# Altium project SPEC_A7.PrjPcb (part 7 of 7)

## Sheet TOD.SchDoc: SPEC-A7
size 420 x 297 mm; Author: G.Kasprowicz; CompanyName: WUT ISE; DrawnBy: G.Kasprowicz; Organization: WUT ISE; Address1: PW ISE; Address2: Nowowiejska 15/19 00-665 Warsaw; Address3: gkasprow@gmail.com; Revision: 2; SheetNumber: 17; SheetTotal: 18; ModifiedBy: -; CheckedDate: -; Title2: TOD IN & OUT; DivGrp: WUT ISE; Designer: G.Kasprowicz; ModifiedDate: -; ProjectName: Sensor Box
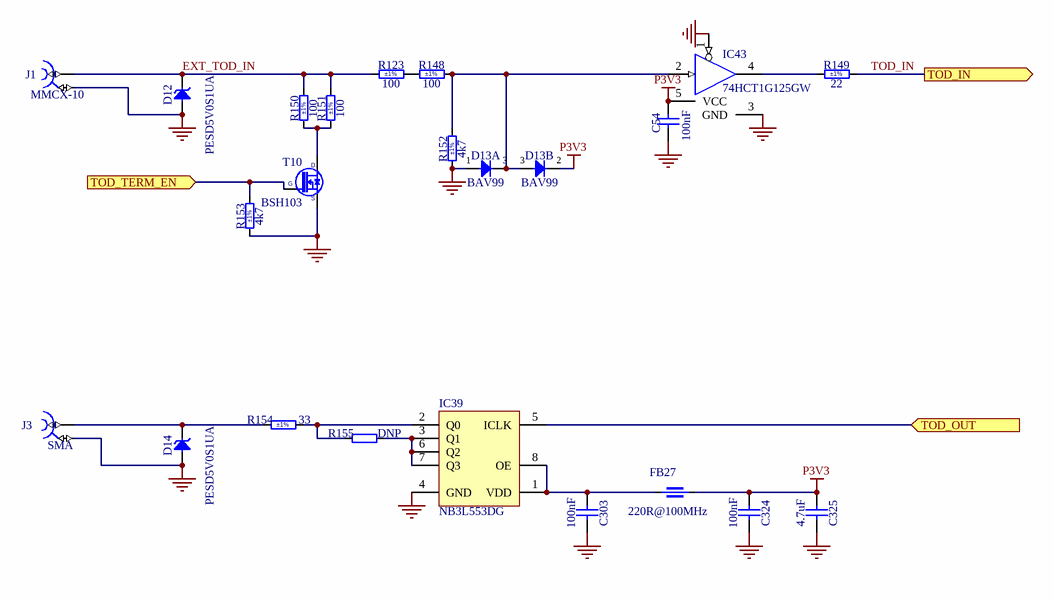
[diagram p16: TOD.SchDoc]

### Parts
C54  100nF  [CAPC0603X33N]
C303  100nF  [CAPC0603X33N]
C324  100nF  [CAPC0603X33N]
C325  4.7uF  [CAPC1005X55N]
D12  PESD5V0S1UA  [SOD2512X110N]
D13  BAV99  [SOT95P240X110-3N]  (parts A,B of 2)
D14  PESD5V0S1UA  [SOD2512X110N]
FB27  220R@100MHz  [INDC1608X95N]
IC39  NB3L553DG  [SOIC127P600X175-8N]
IC43  74HCT1G125GW  [SOT65P210X110-5N]
J1  MMCX-10  [SAMTEC_MMCX-J-P-H-ST-TH1]
J3  SMA  [DELOCK_65848]
R123  100  Tolerance: ±1%  [RESC1005X40N]
R148  100  Tolerance: ±1%  [RESC1005X40N]
R149  22  Tolerance: ±1%  [RESC1005X40N]
R150  100  Tolerance: ±1%  [RESC1005X40N]
R151  100  Tolerance: ±1%  [RESC1005X40N]
R152  4k7  Tolerance: ±1%  [RESC1005X40N]
R153  4k7  Tolerance: ±1%  [RESC1005X40N]
R154  33  Tolerance: ±1%  [RESC2012X60N]
R155  DNP  [RESC1005X40N]  (no BOM)
T10  BSH103  [SOT95P230X110-3N]

### Ports
TOD_IN (out, see SPEC-A7-TOP[3B], FPGA_34[2C]), TOD_OUT (in, see SPEC-A7-TOP[3B], FPGA_34[2D]), TOD_TERM_EN (in, see SPEC-A7-TOP[3B], FPGA_34[2C])

### Nets
GND: C54.1 C303.1 C324.1 C325.1 D12.2(A) D13.1(A) D14.2(A) IC39.4(GND) IC43.1(~{G}) IC43.3(GND) J1.2 J3.2 R152.1 R153.1 T10.2(S)
P3V3: C54.2 C324.2 C325.2 D13.2(C) FB27.1 IC43.5(VCC)
EXT_TOD_IN: D12.1(C) J1.1 R123.1 R150.2 R151.2
TOD_IN: R149.2 ; port TOD_IN
TOD_OUT: IC39.5(ICLK) ; port TOD_OUT
NetC303_2: C303.2 FB27.2 IC39.1(VDD) IC39.8(OE)
NetD13_3: D13.3(COMAC) IC43.2(IN) R148.2 R152.2
NetD14_1: D14.1(C) J3.1 R154.1
NetIC4_T3: R153.2 T10.1(G) ; port TOD_TERM_EN
NetIC39_2: IC39.2(Q0) R154.2 R155.1
NetIC39_3: IC39.3(Q1) IC39.6(Q2) IC39.7(Q3) R155.2
NetIC43_4: IC43.4(OUT) R149.1
NetR123_2: R123.2 R148.1
NetR150_1: R150.1 R151.1 T10.3(D)

### Notes on the sheet
- Project/Equipment
- Document
- Designer
- Drawn by
- Check.by
- Copyright WUT ISE 2024.
  This documentation describes Open Hardware and is licensed under the CERN OHL v.2. You may redistribute and modify this documentation under the terms of the CERN OHL v.2. (http://ohwr.org/CERNOHL). This documentation is distributed WITHOUT ANY EXPRESS OR IMPLIED WARRANTY, INCLUDING OF MERCHANTABILITY, SATISFACTORY QUALITY AND FITNESS FOR A PARTICULAR PURPOSE. Please see the CERN OHL v.2 for applicable conditions.
- Contact
- File
- Last Mod.
- Print Date
- Sheet
- Size
- A3
- of
- Rev

### Library data of the parts
C54 C303 C324 = CC0201_100NF_6.3V_10%_X5R: Non-polarised capacitor; Part Description: SMD Multilayer Chip Ceramic Capacitor; Manufacturer: GENERIC; Manufacturer1 Part Number: 02016D104KAT2A; Voltage: 6.3V; TC: X5R; Tolerance: ±10%; Part Number: CC0201_100NF_6.3V_10%_X5R; Component Kind: Standard; Component Type: Standard; Pin Count: 2; Value: 100nF; Status: Not Recommended; Manufacturer Part Number: CC0201_100NF_6.3V_10%_X5R; Case: 0201; Mounted: Yes; Socket: No; SMD: Yes; Sense: No; Manufacturer1 Example: AVX; Manufacturer1 ComponentHeight: 0.33mm; HelpURL: \\cern.ch\dfs\Applications\Altium\Datasheets\CC0201_X5R_AVX.pdf; Author: CERN DEM JLC; CreateDate: 03.12.2007; LatestRevisionDate: 03.12.2007
C325 = CC0402_4.7UF_6.3V_20%_X5R: Non-polarised capacitor; Part Description: SMD Multilayer Chip Ceramic Capacitor; Manufacturer: GENERIC; Manufacturer1 Part Number: C1005X5R0J475M050BC; Voltage: 6.3V; TC: X5R; Tolerance: ±20%; Part Number: CC0402_4.7UF_6.3V_20%_X5R; Component Kind: Standard; Component Type: Standard; Pin Count: 2; Value: 4.7uF; Status: Preferred; Manufacturer Part Number: CC0402_4.7UF_6.3V_20%_X5R; Case: 0402; Mounted: Yes; Socket: No; SMD: Yes; Sense: No; Manufacturer1 Example: TDK; Manufacturer1 ComponentHeight: 0.65mm; HelpURL: \\cern.ch\dfs\Applications\Altium\Datasheets\CC0402_X5R_TDK_C.pdf; Author: CERN DEM JLC; CreateDate: 03.03.2015; LatestRevisionDate: 03.03.2015
D12 D14 = PESD5V0S1UA: Transient Voltage Suppressor Diode (Uni-Directional); Part Description: Unidirectional ESD Protection for Transient Voltage Suppression; Manufacturer: NXP SEMICONDUCTORS; Voltage: 5V; Power: 890W; PressFit: No; Bonding: No; Part Number: PESD5V0S1UA; Component Kind: Standard; Component Type: Standard; Device: PESD5V0S1UA; PackageDescription: Small Outline Diode (SOD-323), 1.70mm W X 1.25mm L X 1.10mm H body,  IPC Medium Density; Manufacturer Part Number: PESD5V0S1UA; Pin Count: 2; Case: SOD-323; Mounted: Yes; Socket: No; SMD: Yes; Sense: No; ComponentHeight: 1.1mm; HelpURL: \\cern.ch\dfs\Applications\Altium\Datasheets\PESD5V0S1UA.pdf; Author: CERN DEM JLC; CreateDate: 28.08.2012; LatestRevisionDate: 18.09.2013
D13 = BAV99: Serial Diode; Part Description: Dual Series Signal Diode; Manufacturer: FAIRCHILD SEMICONDUCTOR; Voltage: 70V; Power: 350mW; PressFit: No; Bonding: No; Part Number: BAV99; Component Kind: Standard; Component Type: Standard; Device: BAV99; PackageDescription: SOT, 0.95mm Pitch; 3 Pin, 1.40mm W X 3.00mm L X 1.10mm H body, IPC Medium Density; Manufacturer Part Number: BAV99; Pin Count: 3; Case: SOT23-3; Mounted: Yes; Socket: No; SMD: Yes; Sense: No; ComponentHeight: 1.1mm; HelpURL: \\cern.ch\dfs\Applications\Altium\Datasheets\BAV99.pdf; Author: CERN DEM JLC; CreateDate: 06.05.2008; LatestRevisionDate: 27.09.2012
FB27 = IND0603_MURATA_BLM18SG221TN1: Part Description: SMD EMIFIL Suppression Chip Ferrite Bead; Manufacturer: MURATA; Tolerance: ±25%; Power: 2.5A; Resistance: 0.04R; Part Number: IND0603_MURATA_BLM18SG221TN1; Component Kind: Standard; Component Type: Standard; Pin Count: 2; Value: 220R@100MHz; Manufacturer Part Number: BLM18SG221TN1; Case: 0603; Mounted: Yes; Socket: No; SMD: Yes; Sense: No; ComponentHeight: 0.95mm; HelpURL: \\cern.ch\dfs\Applications\Altium\Datasheets\IND0603_MURATA_BLM18S.pdf; Author: CERN DEM MR; CreateDate: 08.01.2016; LatestRevisionDate: 25.10.2018
IC43 = 74HCT1G125GW: Single Bus Buffer Gate With 3-State Output; Part Description: Bus Buffer/Line Driver 3-State; Manufacturer: NEXPERIA; PressFit: No; Bonding: No; Part Number: 74HCT1G125GW; Component Kind: Standard; Component Type: Standard; Device: 74HCT1G125GW; PackageDescription: SOT353, SC70-5, 0.65mm Pitch; 5 Pin, 1.25mm W X 2.00mm L X 1.10mm H body, IPC Medium Density; Manufacturer Part Number: 74HCT1G125GW; Pin Count: 5; Case: SOT353; Mounted: Yes; Socket: No; SMD: Yes; Sense: No; ComponentHeight: 1.1mm; Author: CERN DEM JMW; HelpURL: \\cern.ch\dfs\Applications\Altium\Datasheets\74HCT1G125GW.pdf; CreateDate: 06.08.2020; LatestRevisionDate: 06.08.2020
J1 = SAMTEC_MMCX-J-P-H-ST-TH1: Part Description: Straight Through-hole 50 Ohms Micro Mini RF Jack, MMCX Series; PressFit: No; Part Number: MMCX-10; Component Kind: Standard; Component Type: Standard; Pin Count: 2; Mounted: Yes; Socket: No; SMD: No; Sense: No; Status: None; Manufacturer Part Number: MMCX-10; ComponentHeight: 4.35mm; Author: CERN DEM JLC; CreateDate: 05.12.2012; LatestRevisionDate: 05.12.2012
J3 = DELOCK_65848: 50 Ohm Through Hole SMA Right Angle PCB Jack; Manufacturer: DELOCK; Manufacturer Part Number: 5848 (4043619658480); PressFit: No; Part Number: DELOCK_65848; Component Kind: Standard; Component Type: Standard; Pin Count: 5; Family: SMA; Mounted: Yes; Socket: No; SMD: No; Sense: No; Status: None; Part Description: 50 Ohm Through Hole SMA Right Angle PCB Jack; ComponentHeight: 12.5; HelpURL: \\cern.ch\dfs\Applications\Altium\Datasheets\AMPHENOL_132203-16.pdf; Author: GK; CreateDate: 13.05.2019; LatestRevisionDate: 13.05.2019
R123 R148 R150 R151 = R0402_100R_1%_0.0625W_100PPM: Resistor - 1%; Part Description: General Purpose Thick Film Chip Resistor; Manufacturer: GENERIC; Manufacturer1 Part Number: 232270671001L; TC: ±100ppm/°C; PressFit: No; Part Number: R0402_100R_1%_0.0625W_100PPM; Component Kind: Standard; Component Type: Standard; Pin Count: 2; Value: 100; Status: Not Recommended; Power: 0.0625W; Manufacturer Part Number: R0402_100R_1%_0.0625W_100PPM; Case: 0402; Mounted: Yes; Sense: No; Socket: No; SMD: Yes; Manufacturer1 Example: YAGEO PHYCOMP; Manufacturer1 ComponentHeight: 0.4mm; HelpURL: \\cern.ch\dfs\Applications\Altium\Datasheets\R0402_Phycomp_RC0402.pdf; Author: CERN DEM JLC; CreateDate: 03.12.2007; LatestRevisionDate: 17.10.2012
R149 = R0402_22R_1%_0.0625W_100PPM: Resistor - 1%; Part Description: General Purpose Thick Film Chip Resistor; Manufacturer: GENERIC; Manufacturer1 Part Number: 232270672209L; TC: ±100ppm/°C; PressFit: No; Part Number: R0402_22R_1%_0.0625W_100PPM; Component Kind: Standard; Component Type: Standard; Pin Count: 2; Value: 22; Status: Not Recommended; Power: 0.0625W; Manufacturer Part Number: R0402_22R_1%_0.0625W_100PPM; Case: 0402; Mounted: Yes; Sense: No; Socket: No; SMD: Yes; Manufacturer1 Example: YAGEO PHYCOMP; Manufacturer1 ComponentHeight: 0.4mm; HelpURL: \\cern.ch\dfs\Applications\Altium\Datasheets\R0402_Phycomp_RC0402.pdf; Author: CERN DEM JLC; CreateDate: 03.12.2007; LatestRevisionDate: 17.10.2012
R152 R153 = R0402_4K7_1%_0.0625W_100PPM: as R31 on sheet Power; Part Number: R0402_4K7_1%_0.0625W_100PPM; Component Kind: Standard; Component Type: Standard; Pin Count: 2; Value: 4k7; Status: Not Recommended; Power: 0.0625W; Manufacturer Part Number: R0402_4K7_1%_0.0625W_100PPM; Case: 0402; Mounted: Yes; Sense: No; Socket: No; SMD: Yes; Manufacturer1 Example: YAGEO PHYCOMP; Manufacturer1 ComponentHeight: 0.4mm; HelpURL: \\cern.ch\dfs\Applications\Altium\Datasheets\R0402_Phycomp_RC0402.pdf; Author: CERN DEM JLC; CreateDate: 03.12.2007; LatestRevisionDate: 17.10.2012
R154 = R0805_33R_1%_0.125W_100PPM: Resistor - 1%; Part Description: General Purpose Thick Film Chip Resistor; Manufacturer: GENERIC; Manufacturer1 Part Number: NRC10F33R0TRF; PressFit: No; Power: 0.125W; TC: ±100ppm/°C; Part Number: R0805_33R_1%_0.125W_100PPM; Component Kind: Standard; Component Type: Standard; Pin Count: 2; Value: 33; Status: Preferred; Manufacturer Part Number: R0805_33R_1%_0.125W_100PPM; Case: 0805; Mounted: Yes; Sense: No; Socket: No; SMD: Yes; Manufacturer1 Example: NIC COMPONENT; Manufacturer1 ComponentHeight: 0.6mm; HelpURL: \\cern.ch\dfs\Applications\Altium\Datasheets\R0805_NIC_NRC.pdf; Author: CERN DEM JLC; CreateDate: 03.12.2007; LatestRevisionDate: 13.03.2008
R155 = R0402_0R_JUMPER: as R6 on sheet Power; Part Number: R0402_0R_JUMPER; Component Type: Standard; Pin Count: 2; Value: DNP; Status: Not Recommended; Manufacturer Part Number: R0402_0R_JUMPER; Case: 0402; Mounted: Yes; Sense: No; Socket: No; SMD: Yes; Manufacturer1 Example: YAGEO PHYCOMP; Manufacturer1 ComponentHeight: 0.4mm; HelpURL: \\cern.ch\dfs\Applications\Altium\Datasheets\R0402_Phycomp_RC0402.pdf; Author: CERN DEM JLC; CreateDate: 03.12.2007; LatestRevisionDate: 17.10.2012
T10 = BSH103: as T1 on sheet Power; Part Number: BSH103; Component Kind: Standard; Component Type: Standard; Device: BSH103; PackageDescription: SOT23, 3 pin, Pitch 0.95mm - 1.3mm W X 2.9mm L X 1.1mm H, IPC Medium Density; Manufacturer Part Number: BSH103; Pin Count: 3; Case: SOT23-3; Mounted: Yes; Socket: No; SMD: Yes; Sense: No; ComponentHeight: 1.1mm; HelpURL: \\cern.ch\dfs\Applications\Altium\Datasheets\BSH103.pdf; Author: CERN DEM JLC; CreateDate: 16.03.2010; LatestRevisionDate: 20.06.2017

## Sheet PPS_IN.SchDoc: SPEC-A7
size 420 x 297 mm; Author: G.Kasprowicz; CompanyName: WUT ISE; DrawnBy: G.Kasprowicz; Organization: WUT ISE; Address1: PW ISE; Address2: Nowowiejska 15/19 00-665 Warsaw; Address3: gkasprow@gmail.com; Revision: 2; SheetNumber: 18; SheetTotal: 18; ModifiedBy: -; CheckedDate: -; Title2: PPS IN; DivGrp: WUT ISE; Designer: G.Kasprowicz; ModifiedDate: -; ProjectName: Sensor Box
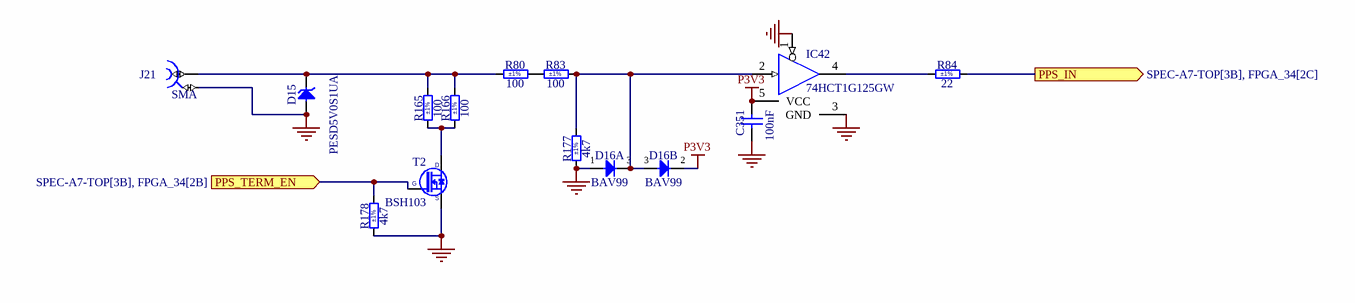
[diagram p17: PPS_IN.SchDoc]

### Parts
C351  100nF  [CAPC0603X33N]
D15  PESD5V0S1UA  [SOD2512X110N]
D16  BAV99  [SOT95P240X110-3N]  (parts A,B of 2)
IC42  74HCT1G125GW  [SOT65P210X110-5N]
J21  SMA  [DELOCK_65848]
R80  100  Tolerance: ±1%  [RESC1005X40N]
R83  100  Tolerance: ±1%  [RESC1005X40N]
R84  22  Tolerance: ±1%  [RESC1005X40N]
R165  100  Tolerance: ±1%  [RESC1005X40N]
R166  100  Tolerance: ±1%  [RESC1005X40N]
R177  4k7  Tolerance: ±1%  [RESC1005X40N]
R178  4k7  Tolerance: ±1%  [RESC1005X40N]
T2  BSH103  [SOT95P230X110-3N]

### Ports
PPS_IN (out, see SPEC-A7-TOP[3B], FPGA_34[2C]), PPS_TERM_EN (in, see SPEC-A7-TOP[3B], FPGA_34[2B])

### Nets
GND: C351.1 D15.2(A) D16.1(A) IC42.1(~{G}) IC42.3(GND) J21.2 R177.1 R178.1 T2.2(S)
P3V3: C351.2 D16.2(C) IC42.5(VCC)
PPS_IN: R84.2 ; port PPS_IN
NetD15_1: D15.1(C) J21.1 R80.1 R165.2 R166.2
NetD16_3: D16.3(COMAC) IC42.2(IN) R83.2 R177.2
NetIC4_L2: R178.2 T2.1(G) ; port PPS_TERM_EN
NetIC42_4: IC42.4(OUT) R84.1
NetR80_2: R80.2 R83.1
NetR165_1: R165.1 R166.1 T2.3(D)

### Notes on the sheet
- Project/Equipment
- Document
- Designer
- Drawn by
- Check.by
- Copyright WUT ISE 2024.
  This documentation describes Open Hardware and is licensed under the CERN OHL v.2. You may redistribute and modify this documentation under the terms of the CERN OHL v.2. (http://ohwr.org/CERNOHL). This documentation is distributed WITHOUT ANY EXPRESS OR IMPLIED WARRANTY, INCLUDING OF MERCHANTABILITY, SATISFACTORY QUALITY AND FITNESS FOR A PARTICULAR PURPOSE. Please see the CERN OHL v.2 for applicable conditions.
- Contact
- File
- Last Mod.
- Print Date
- Sheet
- Size
- A3
- of
- Rev

### Library data of the parts
C351 = CC0201_100NF_6.3V_10%_X5R: as C54 on sheet TOD; Part Number: CC0201_100NF_6.3V_10%_X5R; Component Kind: Standard; Component Type: Standard; Pin Count: 2; Value: 100nF; Status: Not Recommended; Manufacturer Part Number: CC0201_100NF_6.3V_10%_X5R; Case: 0201; Mounted: Yes; Socket: No; SMD: Yes; Sense: No; Manufacturer1 Example: AVX; Manufacturer1 ComponentHeight: 0.33mm; HelpURL: \\cern.ch\dfs\Applications\Altium\Datasheets\CC0201_X5R_AVX.pdf; Author: CERN DEM JLC; CreateDate: 03.12.2007; LatestRevisionDate: 03.12.2007
D15 = PESD5V0S1UA: as D12 on sheet TOD; Part Number: PESD5V0S1UA; Component Kind: Standard; Component Type: Standard; Device: PESD5V0S1UA; PackageDescription: Small Outline Diode (SOD-323), 1.70mm W X 1.25mm L X 1.10mm H body,  IPC Medium Density; Manufacturer Part Number: PESD5V0S1UA; Pin Count: 2; Case: SOD-323; Mounted: Yes; Socket: No; SMD: Yes; Sense: No; ComponentHeight: 1.1mm; HelpURL: \\cern.ch\dfs\Applications\Altium\Datasheets\PESD5V0S1UA.pdf; Author: CERN DEM JLC; CreateDate: 28.08.2012; LatestRevisionDate: 18.09.2013
D16 = BAV99: as D13 on sheet TOD; Part Number: BAV99; Component Kind: Standard; Component Type: Standard; Device: BAV99; PackageDescription: SOT, 0.95mm Pitch; 3 Pin, 1.40mm W X 3.00mm L X 1.10mm H body, IPC Medium Density; Manufacturer Part Number: BAV99; Pin Count: 3; Case: SOT23-3; Mounted: Yes; Socket: No; SMD: Yes; Sense: No; ComponentHeight: 1.1mm; HelpURL: \\cern.ch\dfs\Applications\Altium\Datasheets\BAV99.pdf; Author: CERN DEM JLC; CreateDate: 06.05.2008; LatestRevisionDate: 27.09.2012
IC42 = 74HCT1G125GW: as IC43 on sheet TOD; Part Number: 74HCT1G125GW; Component Kind: Standard; Component Type: Standard; Device: 74HCT1G125GW; PackageDescription: SOT353, SC70-5, 0.65mm Pitch; 5 Pin, 1.25mm W X 2.00mm L X 1.10mm H body, IPC Medium Density; Manufacturer Part Number: 74HCT1G125GW; Pin Count: 5; Case: SOT353; Mounted: Yes; Socket: No; SMD: Yes; Sense: No; ComponentHeight: 1.1mm; Author: CERN DEM JMW; HelpURL: \\cern.ch\dfs\Applications\Altium\Datasheets\74HCT1G125GW.pdf; CreateDate: 06.08.2020; LatestRevisionDate: 06.08.2020
J21 = DELOCK_65848: as J3 on sheet TOD; Part Number: DELOCK_65848; Component Kind: Standard; Component Type: Standard; Pin Count: 5; Family: SMA; Mounted: Yes; Socket: No; SMD: No; Sense: No; Status: None; Part Description: 50 Ohm Through Hole SMA Right Angle PCB Jack; ComponentHeight: 12.5; HelpURL: \\cern.ch\dfs\Applications\Altium\Datasheets\AMPHENOL_132203-16.pdf; Author: GK; CreateDate: 13.05.2019; LatestRevisionDate: 13.05.2019
R80 R83 R165 R166 = R0402_100R_1%_0.0625W_100PPM: as R123 on sheet TOD; Part Number: R0402_100R_1%_0.0625W_100PPM; Component Kind: Standard; Component Type: Standard; Pin Count: 2; Value: 100; Status: Not Recommended; Power: 0.0625W; Manufacturer Part Number: R0402_100R_1%_0.0625W_100PPM; Case: 0402; Mounted: Yes; Sense: No; Socket: No; SMD: Yes; Manufacturer1 Example: YAGEO PHYCOMP; Manufacturer1 ComponentHeight: 0.4mm; HelpURL: \\cern.ch\dfs\Applications\Altium\Datasheets\R0402_Phycomp_RC0402.pdf; Author: CERN DEM JLC; CreateDate: 03.12.2007; LatestRevisionDate: 17.10.2012
R84 = R0402_22R_1%_0.0625W_100PPM: as R149 on sheet TOD; Part Number: R0402_22R_1%_0.0625W_100PPM; Component Kind: Standard; Component Type: Standard; Pin Count: 2; Value: 22; Status: Not Recommended; Power: 0.0625W; Manufacturer Part Number: R0402_22R_1%_0.0625W_100PPM; Case: 0402; Mounted: Yes; Sense: No; Socket: No; SMD: Yes; Manufacturer1 Example: YAGEO PHYCOMP; Manufacturer1 ComponentHeight: 0.4mm; HelpURL: \\cern.ch\dfs\Applications\Altium\Datasheets\R0402_Phycomp_RC0402.pdf; Author: CERN DEM JLC; CreateDate: 03.12.2007; LatestRevisionDate: 17.10.2012
R177 R178 = R0402_4K7_1%_0.0625W_100PPM: as R31 on sheet Power; Part Number: R0402_4K7_1%_0.0625W_100PPM; Component Kind: Standard; Component Type: Standard; Pin Count: 2; Value: 4k7; Status: Not Recommended; Power: 0.0625W; Manufacturer Part Number: R0402_4K7_1%_0.0625W_100PPM; Case: 0402; Mounted: Yes; Sense: No; Socket: No; SMD: Yes; Manufacturer1 Example: YAGEO PHYCOMP; Manufacturer1 ComponentHeight: 0.4mm; HelpURL: \\cern.ch\dfs\Applications\Altium\Datasheets\R0402_Phycomp_RC0402.pdf; Author: CERN DEM JLC; CreateDate: 03.12.2007; LatestRevisionDate: 17.10.2012
T2 = BSH103: as T1 on sheet Power; Part Number: BSH103; Component Kind: Standard; Component Type: Standard; Device: BSH103; PackageDescription: SOT23, 3 pin, Pitch 0.95mm - 1.3mm W X 2.9mm L X 1.1mm H, IPC Medium Density; Manufacturer Part Number: BSH103; Pin Count: 3; Case: SOT23-3; Mounted: Yes; Socket: No; SMD: Yes; Sense: No; ComponentHeight: 1.1mm; HelpURL: \\cern.ch\dfs\Applications\Altium\Datasheets\BSH103.pdf; Author: CERN DEM JLC; CreateDate: 16.03.2010; LatestRevisionDate: 20.06.2017

## Nets that join several sheets
GND: Clocks_PLL (114 pins), FPGA_14_15 (13 pins), DIFF_DELAY_FANOUT (60 pins), VCXO_25M_DDMTD (18 pins), VCXO_25M_PTP (21 pins), SFP (59 pins), FPGA_34 (6 pins), USB_Serial_Quad (61 pins), XO_125M (5 pins), FPGA_PWR_CONFIG (179 pins), Ext_connectors (13 pins), PCIe (23 pins), Power (105 pins), Misc (12 pins), TOD (15 pins), PPS_IN (9 pins)
MGTAVCC: FPGA_PWR_CONFIG (10 pins), Power (R180.2)
MGTAVTT: FPGA_PWR_CONFIG (11 pins), FPGA_MGT (R42.2), Power (R181.2 T3.1 TP9.1)
P1V0: FPGA_PWR_CONFIG (41 pins), Power (R78.2 T1.1 TP7.1)
P1V8: FPGA_PWR_CONFIG (14 pins), Power (R15.2 R179.2 T4.1 TP10.1)
P2V5: FPGA_PWR_CONFIG (20 pins), Power (R183.2 T5.1 TP11.1), Misc (R125.2 R126.2 R127.2)
P3V3: FPGA_14_15 (C329.2 IC41.1 IC41.3), DIFF_DELAY_FANOUT (14 pins), VCXO_25M_DDMTD (8 pins), SFP (16 pins), FPGA_34 (C33.2 IC38.8 R40.2 R41.2), USB_Serial_Quad (11 pins), XO_125M (FB6.1), FPGA_PWR_CONFIG (53 pins), Ext_connectors (J20.26), Power (12 pins), Misc (6 pins), TOD (6 pins), PPS_IN (C351.2 D16.2 IC42.5)
P3V6_CLK: Clocks_PLL (9 pins), VCXO_25M_PTP (FB28.2 FB29.2), Power (R184.2)
P12V0: Ext_connectors (J20.23 J20.24 J20.25), PCIe (5 pins), Power (31 pins)
10M_OUT_SE: DIFF_DELAY_FANOUT (R167.1), FPGA_34 (IC4.N4)
62_5MHZ_N: Clocks_PLL (IC15.47), FPGA_14_15 (IC4.C13)
62_5MHZ_P: Clocks_PLL (IC15.48), FPGA_14_15 (IC4.D13)
125M_CLK_N: XO_125M (R55.2 Y2.5), FPGA_MGT (C45.1 C50.1)
125M_CLK_P: XO_125M (R56.2 Y2.4), FPGA_MGT (C44.1 C48.1)
CFG_TCK: USB_Serial_Quad (IC31.4), FPGA_PWR_CONFIG (D2.3 IC4.F8 J6.6)
CFG_TDI: USB_Serial_Quad (IC31.5), FPGA_PWR_CONFIG (D3.3 IC4.T9 J6.10)
CFG_TDO: USB_Serial_Quad (IC33.4), FPGA_PWR_CONFIG (D3.2 IC4.T8 J6.8)
CFG_TMS: USB_Serial_Quad (IC33.5), FPGA_PWR_CONFIG (D2.2 IC4.R8 J6.4)
CLK_25M: Clocks_PLL (IC14.64), VCXO_25M_PTP (C151.2)
CLK_25M_DMTD: FPGA_14_15 (IC4.T14), VCXO_25M_DDMTD (OSC2#1.4 Y1.4)
CLK_125M_N: FPGA_14_15 (IC4.D16), FPGA_MGT (C50.2)
CLK_125M_P: FPGA_14_15 (IC4.E16), FPGA_MGT (C48.2)
DAC_LDAC: FPGA_14_15 (IC4.U12), VCXO_25M_PTP (IC10.4)
DAC_SCLK: FPGA_14_15 (IC4.V14), VCXO_25M_PTP (IC10.6)
DAC_SDI: FPGA_14_15 (IC4.T13), VCXO_25M_PTP (IC10.8)
DAC_SDO: FPGA_14_15 (IC4.V12), VCXO_25M_PTP (IC10.3)
DAC_SYNC: FPGA_14_15 (IC4.V13), VCXO_25M_PTP (IC10.7)
DDMTD_LDAC: FPGA_14_15 (IC4.N17), VCXO_25M_DDMTD (IC7.4)
DDMTD_SCLK: FPGA_14_15 (IC4.K17), VCXO_25M_DDMTD (IC7.6)
DDMTD_SDI: FPGA_14_15 (IC4.L18), VCXO_25M_DDMTD (IC7.8)
DDMTD_SDO: FPGA_14_15 (IC4.N18), VCXO_25M_DDMTD (IC7.3)
DDMTD_SYNC: FPGA_14_15 (IC4.M17), VCXO_25M_DDMTD (IC7.7)
DELAY_EN: FPGA_14_15 (IC4.J18), DIFF_DELAY_FANOUT (IC20.2)
DELAY_Q0_N: DIFF_DELAY_FANOUT (IC23.11), Ext_connectors (J18.18)
DELAY_Q0_P: DIFF_DELAY_FANOUT (IC23.12), Ext_connectors (J18.17)
DELAY_Q1_N: DIFF_DELAY_FANOUT (IC25.11), Ext_connectors (J18.24)
DELAY_Q1_P: DIFF_DELAY_FANOUT (IC25.12), Ext_connectors (J18.23)
DELAY_SCLK: FPGA_14_15 (IC4.K18), DIFF_DELAY_FANOUT (IC20.5)
DELAY_SDIN: FPGA_14_15 (IC4.J14), DIFF_DELAY_FANOUT (IC20.4)
DELAY_SLOAD: FPGA_14_15 (IC4.M16), DIFF_DELAY_FANOUT (IC20.3)
DLY0_SE_FB: FPGA_14_15 (IC4.P14), DIFF_DELAY_FANOUT (IC24.6)
DLY1_SE_FB: FPGA_14_15 (IC4.R15), DIFF_DELAY_FANOUT (IC26.6)
EXT_CLK_0_N: Clocks_PLL (IC14.55), Ext_connectors (J18.3)
EXT_CLK_0_P: Clocks_PLL (IC14.56), Ext_connectors (J18.2)
EXT_CLK_1_N: Clocks_PLL (IC14.52), Ext_connectors (J18.6)
EXT_CLK_1_P: Clocks_PLL (IC14.53), Ext_connectors (J18.5)
EXT_CLK_4_N: Clocks_PLL (IC14.25), Ext_connectors (J18.21)
EXT_CLK_4_P: Clocks_PLL (IC14.26), Ext_connectors (J18.20)
EXT_CLK_5_N: Clocks_PLL (IC14.28), Ext_connectors (J18.15)
EXT_CLK_5_P: Clocks_PLL (IC14.29), Ext_connectors (J18.14)
EXT_CLK_6_N: Clocks_PLL (IC14.47), Ext_connectors (J18.9)
EXT_CLK_6_P: Clocks_PLL (IC14.48), Ext_connectors (J18.8)
EXT_CLK_9_N: Clocks_PLL (IC14.36), Ext_connectors (J18.12)
EXT_CLK_9_P: Clocks_PLL (IC14.35), Ext_connectors (J18.11)
EXT_CLK_N: Clocks_PLL (IC13.9), FPGA_14_15 (IC4.D14)
EXT_CLK_P: Clocks_PLL (IC13.8), FPGA_14_15 (IC4.E13)
EXT_PLL_CS: Clocks_PLL (IC15.17), FPGA_34 (IC4.R3)
EXT_PLL_LOCK: Clocks_PLL (IC15.3), FPGA_34 (IC4.L3)
EXT_PLL_REFSEL: Clocks_PLL (IC15.7), FPGA_34 (IC4.L4)
EXT_PLL_SCLK: Clocks_PLL (IC15.16), FPGA_34 (IC4.T2)
EXT_PLL_SDI: Clocks_PLL (IC15.22), FPGA_34 (IC4.U4)
EXT_PLL_SDO: Clocks_PLL (IC15.21), FPGA_34 (IC4.V4)
EXT_PLL_STAT: Clocks_PLL (IC15.6), FPGA_34 (IC4.R1)
EXT_PLL_SYNC: Clocks_PLL (IC15.8), FPGA_34 (IC4.R2)
EXT_RESET: Clocks_PLL (IC15.23 IC15.24 R67.2), FPGA_34 (IC4.V6)
FPGA_GCLK_N: Clocks_PLL (IC14.34), FPGA_14_15 (IC4.D15)
FPGA_GCLK_P: Clocks_PLL (IC14.33), FPGA_14_15 (IC4.E15)
GPIO0: FPGA_34 (IC4.M1), Ext_connectors (J20.17)
GPIO1: FPGA_34 (IC4.V3), Ext_connectors (J20.18)
GPIO2: FPGA_34 (IC4.U2), Ext_connectors (J20.19)
GPIO3: FPGA_34 (IC4.N1), Ext_connectors (J20.20)
GPIO4: FPGA_34 (IC4.P1), Ext_connectors (J20.21)
GTP_CLK_REF_N: Clocks_PLL (IC14.45), FPGA_MGT (C47.1)
GTP_CLK_REF_P: Clocks_PLL (IC14.46), FPGA_MGT (C46.1)
HW_REV0: FPGA_14_15 (IC4.D10), Misc (R125.1 R128.2)
HW_REV1: FPGA_14_15 (IC4.A14), Misc (R126.1 R129.2)
HW_REV2: FPGA_14_15 (IC4.A13), Misc (R127.1 R130.2)
I2C_SCL: FPGA_34 (IC4.N2 IC38.6 R41.1), Ext_connectors (J18.26)
I2C_SDA: FPGA_34 (IC4.M2 IC38.5 R40.1), Ext_connectors (J18.25)
LED0: FPGA_14_15 (IC4.H14), Misc (T11.1)
LED1: FPGA_14_15 (IC4.G14), Misc (T12.1)
LED2: FPGA_14_15 (IC4.H17), Misc (T13.1)
LED3: FPGA_14_15 (IC4.E18), Misc (T14.1)
LMX_CS: Clocks_PLL (IC16.24), FPGA_34 (IC4.K2)
LMX_SCK: Clocks_PLL (IC16.16), FPGA_34 (IC4.K1)
LMX_SDI: Clocks_PLL (IC16.17), FPGA_34 (IC4.K5)
LMX_SYNC: Clocks_PLL (IC16.5), FPGA_34 (IC4.K6)
LOCK: FPGA_14_15 (IC4.B17), Misc (J19.3)
NetC134_2: USB_Serial_Quad (T9.1), FPGA_PWR_CONFIG (C134.2 J6.13 R49.1)
NetIC4_L2: FPGA_34 (IC4.L2), PPS_IN (R178.2 T2.1)
NetIC4_T3: FPGA_34 (IC4.T3), TOD (R153.2 T10.1)
NetIC16_8: Clocks_PLL (IC16.8), VCXO_25M_PTP (R53.2)
OE_125M: FPGA_14_15 (IC4.F14), XO_125M (Y2.1)
ONE_WIRE: FPGA_14_15 (IC4.U14), Misc (IC37.1 R124.1)
OUT_2_N: Clocks_PLL (IC14.42), DIFF_DELAY_FANOUT (IC21.4 R87.1 R141.1)
OUT_2_P: Clocks_PLL (IC14.43), DIFF_DELAY_FANOUT (IC21.3 R86.1 R139.1)
OUT_3_N: Clocks_PLL (IC14.39), DIFF_DELAY_FANOUT (IC22.4 R90.1 R144.1)
OUT_3_P: Clocks_PLL (IC14.40), DIFF_DELAY_FANOUT (IC22.3 R89.1 R143.1)
PCIe_PER0_N: FPGA_MGT (IC4.E3), PCIe (J14.b15)
PCIe_PER0_P: FPGA_MGT (IC4.E4), PCIe (J14.b14)
PCIe_PER1_N: FPGA_MGT (IC4.A3), PCIe (J14.b20)
PCIe_PER1_P: FPGA_MGT (IC4.A4), PCIe (J14.b19)
PCIe_PET0_N: FPGA_MGT (C51.2), PCIe (J14.a17)
PCIe_PET0_P: FPGA_MGT (C49.2), PCIe (J14.a16)
PCIe_PET1_N: FPGA_MGT (C55.2), PCIe (J14.a22)
PCIe_PET1_P: FPGA_MGT (C53.2), PCIe (J14.a21)
PCIe_REFCLK_N: FPGA_MGT (C336.1), PCIe (J14.a14)
PCIe_REFCLK_P: FPGA_MGT (C335.1), PCIe (J14.a13)
PCIe_RST: FPGA_34 (IC4.R6), PCIe (J14.a11 R104.2)
PLL_CS: Clocks_PLL (IC14.17), FPGA_14_15 (IC4.V9)
PLL_LOCK: Clocks_PLL (IC14.3), FPGA_14_15 (IC4.U16)
PLL_REFSEL: Clocks_PLL (IC14.7), FPGA_14_15 (IC4.U15)
PLL_RESET: Clocks_PLL (IC14.23 IC14.24 R66.2), FPGA_14_15 (IC4.U11)
PLL_SCLK: Clocks_PLL (IC14.16), FPGA_14_15 (IC4.V11)
PLL_SDI: Clocks_PLL (IC14.22), FPGA_14_15 (IC4.U10)
PLL_SDO: Clocks_PLL (IC14.21), FPGA_14_15 (IC4.U9)
PLL_STAT: Clocks_PLL (IC14.6), FPGA_14_15 (IC4.V16)
PLL_SYNC: Clocks_PLL (IC14.8), FPGA_14_15 (IC4.P16)
PPS_IN: FPGA_34 (IC4.P3), PPS_IN (R84.2)
PPS_OUT_SE: DIFF_DELAY_FANOUT (R168.1), FPGA_34 (IC4.M4)
QSPI_CS: FPGA_14_15 (IC4.L15), FPGA_PWR_CONFIG (IC6.1 IC17.10 R45.2)
QSPI_DQ0: FPGA_14_15 (IC4.K16), FPGA_PWR_CONFIG (IC6.5 IC17.3)
QSPI_DQ1: FPGA_14_15 (IC4.L17), FPGA_PWR_CONFIG (IC6.2 IC17.9)
QSPI_DQ2: FPGA_14_15 (IC4.J15), FPGA_PWR_CONFIG (IC6.3 R46.2)
QSPI_DQ3: FPGA_14_15 (IC4.J16), FPGA_PWR_CONFIG (IC6.7 R47.2)
RESET: FPGA_14_15 (IC4.K15), Misc (J19.1)
RESV_I: FPGA_14_15 (IC4.H18), Misc (J19.5)
RESV_O: FPGA_14_15 (IC4.F15), Misc (J19.7)
RGMII_RX_CLK: FPGA_34 (IC4.N3), Ext_connectors (J20.3)
RGMII_RX_DV: FPGA_34 (IC4.N6), Ext_connectors (J20.2)
RGMII_RXD0: FPGA_34 (IC4.M6), Ext_connectors (J20.5)
RGMII_RXD1: FPGA_34 (IC4.V2), Ext_connectors (J20.6)
RGMII_RXD2: FPGA_34 (IC4.P5), Ext_connectors (J20.7)
RGMII_RXD3: FPGA_34 (IC4.T5), Ext_connectors (J20.8)
RGMII_TX_CLK: FPGA_34 (R163.2), Ext_connectors (J20.16)
RGMII_TX_EN: FPGA_34 (R159.2), Ext_connectors (J20.15)
RGMII_TXD0: FPGA_34 (R160.2), Ext_connectors (J20.10)
RGMII_TXD1: FPGA_34 (R161.2), Ext_connectors (J20.11)
RGMII_TXD2: FPGA_34 (R164.2), Ext_connectors (J20.12)
RGMII_TXD3: FPGA_34 (R162.2), Ext_connectors (J20.13)
RX: SPEC-A7-TOP (R1.2), FPGA_14_15 (IC4.R16)
RXD_USB: SPEC-A7-TOP (R2.1), USB_Serial_Quad (IC36.5 R173.1 TP16.1)
SFP0_DISABLE: FPGA_14_15 (IC4.U17), SFP (J12.3)
SFP0_FAULT: FPGA_14_15 (IC4.V17), SFP (J12.2 R94.1)
SFP0_I_N: SFP (J12.19), FPGA_MGT (IC4.D1)
SFP0_I_P: SFP (J12.18), FPGA_MGT (IC4.D2)
SFP0_LOSE: FPGA_14_15 (IC4.P18), SFP (J12.8 R95.1)
SFP0_MODE0: FPGA_14_15 (IC4.R18), SFP (J12.6 R96.1)
SFP0_MODE1: FPGA_14_15 (IC4.T18), SFP (J12.5)
SFP0_MODE2: FPGA_14_15 (IC4.T17), SFP (J12.4)
SFP0_O_N: SFP (J12.12), FPGA_MGT (IC4.C3)
SFP0_O_P: SFP (J12.13), FPGA_MGT (IC4.C4)
SFP0_RS: FPGA_14_15 (IC4.N16), SFP (J12.7 R98.2)
SFP1_DISABLE: FPGA_14_15 (IC4.M15), SFP (J13.3)
SFP1_FAULT: FPGA_14_15 (IC4.L14), SFP (J13.2 R100.1)
SFP1_I_N: SFP (J13.19), FPGA_MGT (IC4.B1)
SFP1_I_P: SFP (J13.18), FPGA_MGT (IC4.B2)
SFP1_LOSE: FPGA_14_15 (IC4.P15), SFP (J13.8 R101.1)
SFP1_MODE0: FPGA_14_15 (IC4.T12), SFP (J13.6 R102.1)
SFP1_MODE1: FPGA_14_15 (IC4.N14), SFP (J13.5)
SFP1_MODE2: FPGA_14_15 (IC4.M14), SFP (J13.4)
SFP1_O_N: SFP (J13.12), FPGA_MGT (IC4.G3)
SFP1_O_P: SFP (J13.13), FPGA_MGT (IC4.G4)
SFP1_RS: FPGA_14_15 (IC4.R13), SFP (J13.7 R103.2)
SFP_0.LED: FPGA_14_15 (IC4.G16), SFP (T7.1)
SFP_1.LED: FPGA_14_15 (IC4.G15), SFP (T8.1)
SYNC_DATA0_N: FPGA_14_15 (IC4.A9), DIFF_DELAY_FANOUT (IC21.2 R85.1)
SYNC_DATA0_P: FPGA_14_15 (IC4.B9), DIFF_DELAY_FANOUT (IC21.1 R85.2)
SYNC_DATA1_N: FPGA_14_15 (IC4.C8), DIFF_DELAY_FANOUT (IC22.2 R88.1)
SYNC_DATA1_P: FPGA_14_15 (IC4.D8), DIFF_DELAY_FANOUT (IC22.1 R88.2)
TOD_IN: FPGA_34 (IC4.P4), TOD (R149.2)
TOD_OUT: FPGA_34 (IC4.V8), TOD (IC39.5)
TX: SPEC-A7-TOP (R2.2), FPGA_14_15 (IC4.R17)
TXD_USB: SPEC-A7-TOP (R1.1), USB_Serial_Quad (IC36.4 R171.2 TP17.1)

## Assembly variants
Professional: not fitted C44 C45 C299 C300 C331 C333 C334 IC9 IC12 IC29 J19 OSC2 R54 R125 R127 R129 R137 R138 R139 R140 R141 R142 R143 R144 R167 R168 R171 R172 R173 R174 R175 R176 R200